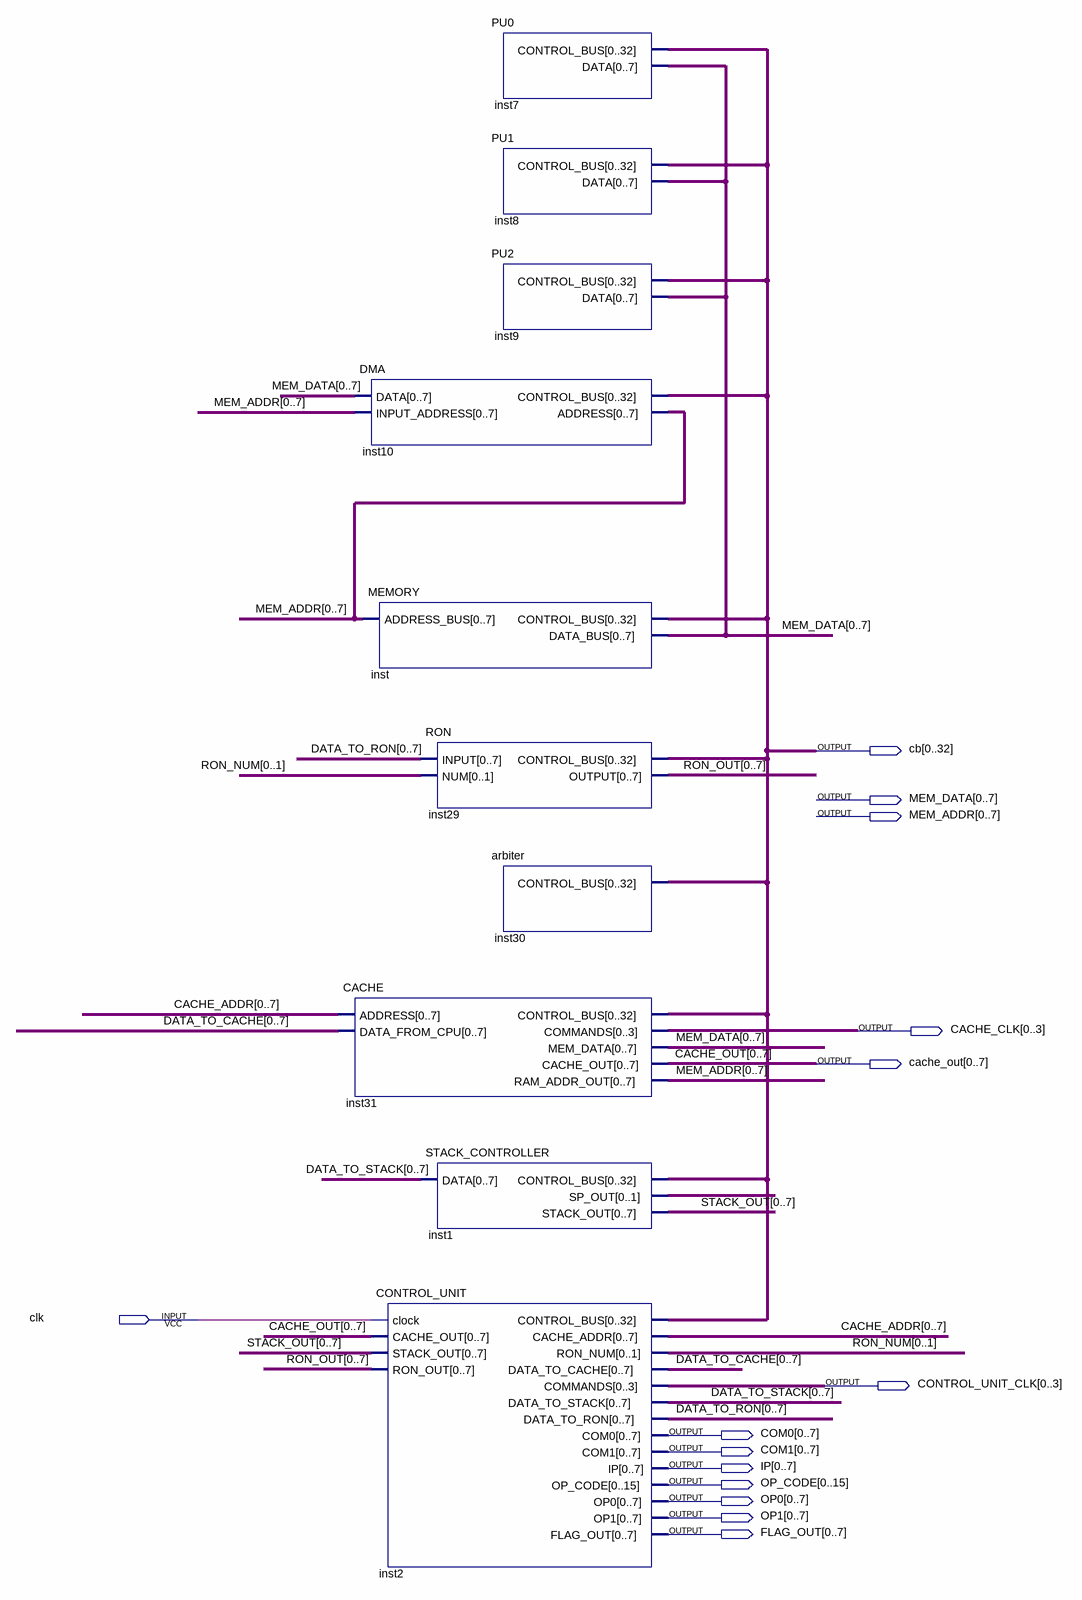
[diagram p0: schematic sheet]
// Quartus schematic microcomputer.bdf as structural Verilog: 10 symbols, 14 pins
module microcomputer (
  input  clk,
  output [0:32] cb,
  output [0:7] MEM_DATA,
  output [0:7] MEM_ADDR,
  output [0:3] CACHE_CLK,
  output [0:7] cache_out,
  output [0:3] CONTROL_UNIT_CLK,
  output [0:7] COM0,
  output [0:7] COM1,
  output [0:7] IP,
  output [0:15] OP_CODE,
  output [0:7] OP0,
  output [0:7] OP1,
  output [0:7] FLAG_OUT
);

  wire [1:0] inst1_sp_out, RON_NUM;
  wire [7:0] CACHE_ADDR, DATA_TO_CACHE, DATA_TO_RON, DATA_TO_STACK, RON_OUT, STACK_OUT;

  DMA inst10 (.DATA(MEM_DATA), .INPUT_ADDRESS(MEM_ADDR), .ADDRESS(MEM_ADDR), .CONTROL_BUS(cb));
  CACHE inst31 (
    .ADDRESS({CACHE_ADDR[0], CACHE_ADDR[1], CACHE_ADDR[2], CACHE_ADDR[3], CACHE_ADDR[4], CACHE_ADDR[5], CACHE_ADDR[6], CACHE_ADDR[7]}),
    .DATA_FROM_CPU({DATA_TO_CACHE[0], DATA_TO_CACHE[1], DATA_TO_CACHE[2], DATA_TO_CACHE[3], DATA_TO_CACHE[4], DATA_TO_CACHE[5], DATA_TO_CACHE[6], DATA_TO_CACHE[7]}),
    .COMMANDS(CACHE_CLK), .CACHE_OUT(cache_out), .RAM_ADDR_OUT(MEM_ADDR), .CONTROL_BUS(cb),
    .MEM_DATA(MEM_DATA));
  MEMORY inst (.ADDRESS_BUS(MEM_ADDR), .CONTROL_BUS(cb), .DATA_BUS(MEM_DATA));
  RON inst29 (
    .INPUT({DATA_TO_RON[0], DATA_TO_RON[1], DATA_TO_RON[2], DATA_TO_RON[3], DATA_TO_RON[4], DATA_TO_RON[5], DATA_TO_RON[6], DATA_TO_RON[7]}),
    .NUM({RON_NUM[0], RON_NUM[1]}),
    .OUTPUT({RON_OUT[0], RON_OUT[1], RON_OUT[2], RON_OUT[3], RON_OUT[4], RON_OUT[5], RON_OUT[6], RON_OUT[7]}),
    .CONTROL_BUS(cb));
  STACK_CONTROLLER inst1 (
    .DATA({DATA_TO_STACK[0], DATA_TO_STACK[1], DATA_TO_STACK[2], DATA_TO_STACK[3], DATA_TO_STACK[4], DATA_TO_STACK[5], DATA_TO_STACK[6], DATA_TO_STACK[7]}),
    .SP_OUT(inst1_sp_out),
    .STACK_OUT({STACK_OUT[0], STACK_OUT[1], STACK_OUT[2], STACK_OUT[3], STACK_OUT[4], STACK_OUT[5], STACK_OUT[6], STACK_OUT[7]}),
    .CONTROL_BUS(cb));
  CONTROL_UNIT inst2 (
    .clock(clk), .CACHE_OUT(cache_out),
    .STACK_OUT({STACK_OUT[0], STACK_OUT[1], STACK_OUT[2], STACK_OUT[3], STACK_OUT[4], STACK_OUT[5], STACK_OUT[6], STACK_OUT[7]}),
    .RON_OUT({RON_OUT[0], RON_OUT[1], RON_OUT[2], RON_OUT[3], RON_OUT[4], RON_OUT[5], RON_OUT[6], RON_OUT[7]}),
    .CACHE_ADDR({CACHE_ADDR[0], CACHE_ADDR[1], CACHE_ADDR[2], CACHE_ADDR[3], CACHE_ADDR[4], CACHE_ADDR[5], CACHE_ADDR[6], CACHE_ADDR[7]}),
    .RON_NUM({RON_NUM[0], RON_NUM[1]}),
    .DATA_TO_CACHE({DATA_TO_CACHE[0], DATA_TO_CACHE[1], DATA_TO_CACHE[2], DATA_TO_CACHE[3], DATA_TO_CACHE[4], DATA_TO_CACHE[5], DATA_TO_CACHE[6], DATA_TO_CACHE[7]}),
    .COMMANDS(CONTROL_UNIT_CLK),
    .DATA_TO_STACK({DATA_TO_STACK[0], DATA_TO_STACK[1], DATA_TO_STACK[2], DATA_TO_STACK[3], DATA_TO_STACK[4], DATA_TO_STACK[5], DATA_TO_STACK[6], DATA_TO_STACK[7]}),
    .DATA_TO_RON({DATA_TO_RON[0], DATA_TO_RON[1], DATA_TO_RON[2], DATA_TO_RON[3], DATA_TO_RON[4], DATA_TO_RON[5], DATA_TO_RON[6], DATA_TO_RON[7]}),
    .COM0(COM0), .COM1(COM1), .IP(IP), .OP_CODE(OP_CODE), .OP0(OP0), .OP1(OP1), .FLAG_OUT(FLAG_OUT),
    .CONTROL_BUS(cb));
  PU0 inst7 (.CONTROL_BUS(cb), .DATA(MEM_DATA));
  PU1 inst8 (.CONTROL_BUS(cb), .DATA(MEM_DATA));
  PU2 inst9 (.CONTROL_BUS(cb), .DATA(MEM_DATA));
  arbiter inst30 (.CONTROL_BUS(cb));
endmodule
